# Altium project Detection_Circuit.PrjPcb
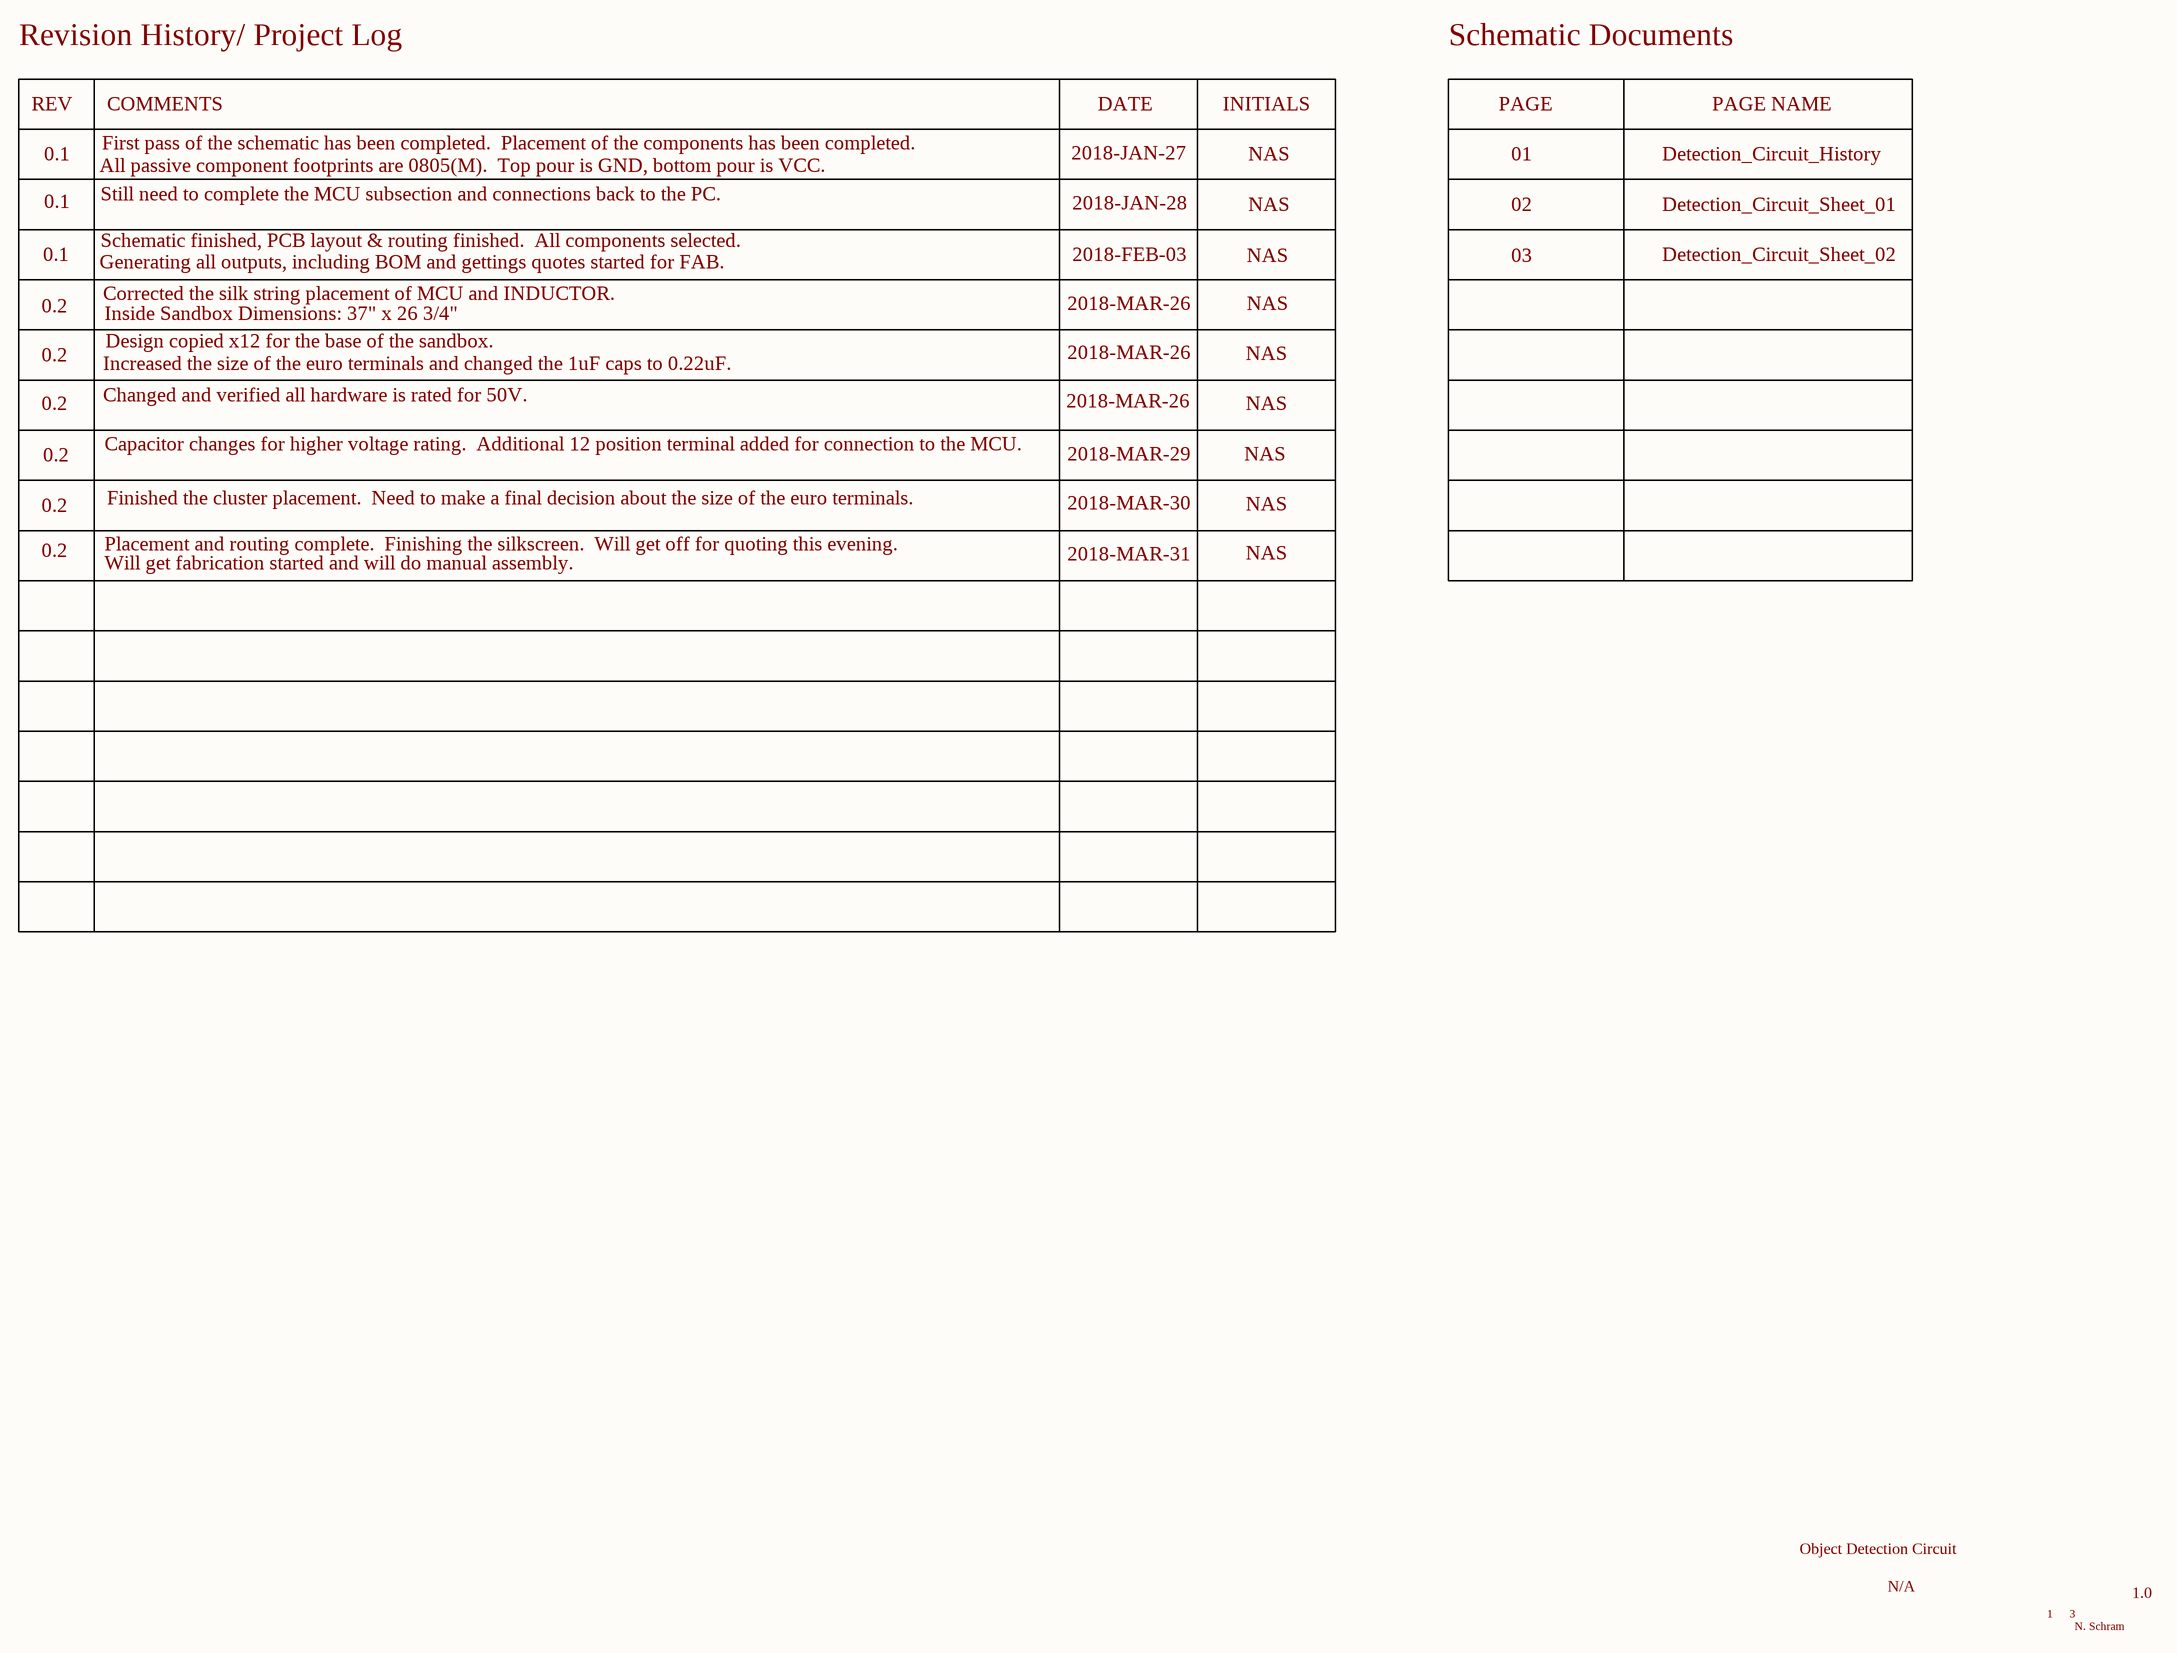
[diagram p0: Detection_Circuit_History.SchDoc]
2 sheets, 41 parts. Net scope: global (net labels, ports and power ports of the same name join across sheets).
Board file: Detection_Circuit_PCB.PcbDoc
Sheets:
  Detection_Circuit_History.SchDoc
  Detection_Circuit_Sheet_01.SchDoc

## Sheet Detection_Circuit_History.SchDoc: Object Detection PCB
size C; Date: 2018-FEB-03; Author: Nathan Schram; DrawnBy: Nathan Schram; Engineer: Nathan Schram; Revision: 1.0; SheetNumber: 1; SheetTotal: 2; DocumentName: Object Detection PCB; ProjectName: Augmented Reality Project

### Notes on the sheet
- Revision History/ Project Log
- Schematic Documents
- REV
- COMMENTS
- DATE
- INITIALS
- PAGE
- PAGE NAME
- 0.1
- All passive component footprints are 0805(M).  Top pour is GND, bottom pour is VCC.
- First pass of the schematic has been completed.  Placement of the components has been completed.
- 2018-JAN-27
- NAS
- 01
- Detection_Circuit_History
- Still need to complete the MCU subsection and connections back to the PC.
- Schematic finished, PCB layout & routing finished.  All components selected.
- 2018-JAN-28
- 02
- Detection_Circuit_Sheet_01
- 0.2
- Generating all outputs, including BOM and gettings quotes started for FAB.
- Corrected the silk string placement of MCU and INDUCTOR.
- 2018-MAR-26
- 2018-FEB-03
- 03
- Detection_Circuit_Sheet_02
- Increased the size of the euro terminals and changed the 1uF caps to 0.22uF.
- Inside Sandbox Dimensions: 37" x 26 3/4"
- Design copied x12 for the base of the sandbox.
- Changed and verified all hardware is rated for 50V.
- Capacitor changes for higher voltage rating.  Additional 12 position terminal added for connection to the MCU.
- Finished the cluster placement.  Need to make a final decision about the size of the euro terminals.
- 2018-MAR-29
- Placement and routing complete.  Finishing the silkscreen.  Will get off for quoting this evening.
- 2018-MAR-30
- 2018-MAR-31
- Will get fabrication started and will do manual assembly.
- Object Detection Circuit
- N/A
- 1
- 3
- N. Schram
- 1.0

## Sheet Detection_Circuit_Sheet_01.SchDoc: Object Detection PCB
size A; Date: 2018-FEB-03; Author: Nathan Schram; DrawnBy: Nathan Schram; Engineer: Nathan Schram; Revision: 1.0; SheetNumber: 2; SheetTotal: 2; ProjectName: Augmented Reality Project
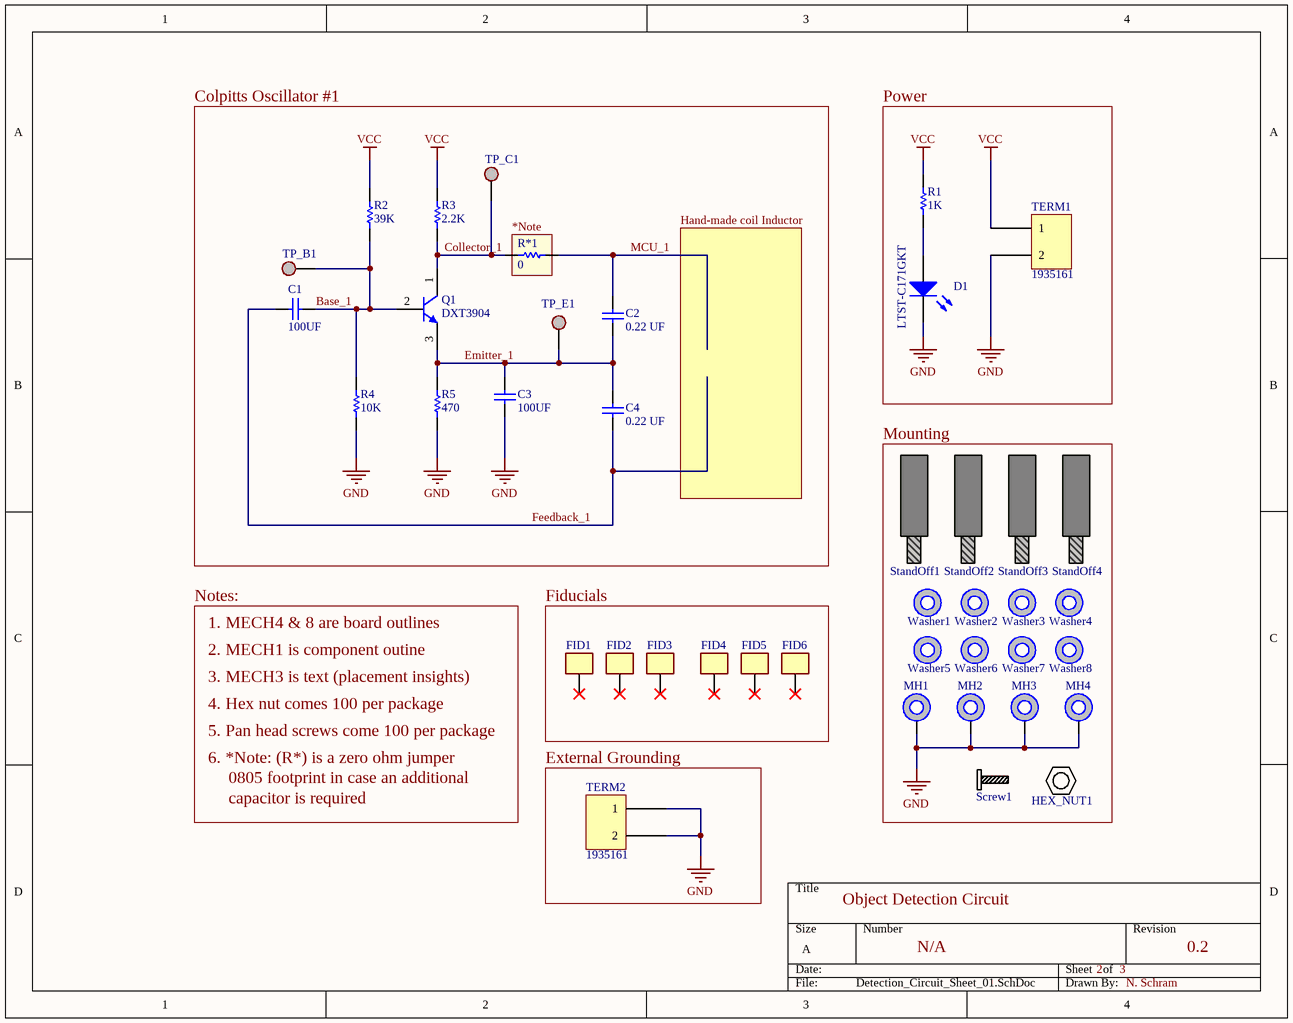
[diagram p1: Detection_Circuit_Sheet_01.SchDoc]

### Parts
C1  100UF  [C1210_M]
C2  Capacitance: 0.22 UF  [6-0805_N]  (hidden comment: 08055C224JAT2A)
C3  100UF  [C1210_M]
C4  Capacitance: 0.22 UF  [6-0805_N]  (hidden comment: 08055C224JAT2A)
D1  LTST-C171GKT  [6-0805_M]
FID1  Fiducial  [Fiducial]  (value not drawn)
FID2  Fiducial  [Fiducial]  (value not drawn)
FID3  Fiducial  [Fiducial]  (value not drawn)
FID4  Fiducial  [Fiducial]  (value not drawn)
FID5  Fiducial  [Fiducial]  (value not drawn)
FID6  Fiducial  [Fiducial]  (value not drawn)
HEX_NUT1  6-32 Hex Nut  (value not drawn)
MH1  #6 MH  [#6_MH]  (value not drawn)
MH2  #6 MH  [#6_MH]  (value not drawn)
MH3  #6 MH  [#6_MH]  (value not drawn)
MH4  #6 MH  [#6_MH]  (value not drawn)
Q1  DXT3904  [DXT3904-13]
R1  1K  [6-0805_M]
R2  39K  [6-0805_M]
R3  2.2K  [6-0805_M]
R4  10K  [6-0805_M]
R5  470  [6-0805_M]
R*1  0  [6-0805_M]
Screw1  6-32 Pan Head Screw  (value not drawn)
StandOff1  6-32 Stand Off  (value not drawn)
StandOff2  6-32 Stand Off  (value not drawn)
StandOff3  6-32 Stand Off  (value not drawn)
StandOff4  6-32 Stand Off  (value not drawn)
TERM1  1935161  [1935161]
TERM2  1935161  [1935161]
TP_B1  TestPoint  [TestPoint]  (value not drawn)
TP_C1  TestPoint  [TestPoint]  (value not drawn)
TP_E1  TestPoint  [TestPoint]  (value not drawn)
Washer1  Nylon Washer  (value not drawn)
Washer2  Nylon Washer  (value not drawn)
Washer3  Nylon Washer  (value not drawn)
Washer4  Nylon Washer  (value not drawn)
Washer5  Nylon Washer  (value not drawn)
Washer6  Nylon Washer  (value not drawn)
Washer7  Nylon Washer  (value not drawn)
Washer8  Nylon Washer  (value not drawn)

### Blocks framed on the sheet
Colpitts Oscillator #1: C1-C4 Q1 R2-R5 R*1 TP_B1 TP_C1 TP_E1
Power: D1 R1 TERM1
Mounting: HEX_NUT1 MH1-MH4 Screw1 StandOff1-StandOff4 Washer1-Washer8
Fiducials: FID1-FID6
External Grounding: TERM2

### Nets
GND: C3.1 D1.2(K) MH1.MH MH2.MH MH3.MH MH4.MH R4.1 R5.1 TERM1.2 TERM2.1 TERM2.2
VCC: R1.2 R2.2 R3.2 TERM1.1
Base_1: C1.2 Q1.2(B) R2.1 R4.2 TP_B1.1
Collector_1: Q1.1(C) R3.1 R*1.1 TP_C1.1
Emitter_1: C2.1 C3.2 C4.2 Q1.3(E) R5.2 TP_E1.1
Feedback_1: C1.1 C4.1
MCU_1: C2.2 R*1.2
NetD1_1: D1.1(A) R1.1

Not connected (* = marked no-connect by the designer): FID1 FID*; FID2 FID*; FID3 FID*; FID4 FID*; FID5 FID*; FID6 FID*

### Notes on the sheet
- (near R*1) *Note
- Hand-made coil Inductor
- Notes:
- 1. MECH4 & 8 are board outlines
- 2. MECH1 is component outine
- 3. MECH3 is text (placement insights)
- 4. Hex nut comes 100 per package
- 5. Pan head screws come 100 per package
- 6. *Note: (R*) is a zero ohm jumper
- 0805 footprint in case an additional
- capacitor is required
- Object Detection Circuit
- N/A
- 2
- 3
- 0.2
- N. Schram

### Library data of the parts
C1 C3 = CC1210MKX5R7BB107: CAP CER 100UF 16V X5R 1210; Manufacturer: Yageo; Capacitance: 100µF; Tolerance: ±20%; Supplier 1: Digi-Key; Manufacturer Part Number: CC1210MKX5R7BB107; Family: Ceramic Capacitors; Series: CC; Packaging: Tape & Reel (TR); Voltage - Rated: 16V; Temperature Coefficient: X5R; Mounting Type: Surface Mount, MLCC; Operating Temperature: -55°C ~ 85°C; Applications: General Purpose; Ratings: -; Package / Case: 1210 (3225 Metric); Size / Dimension: 0.126" L x 0.098" W (3.20mm x 2.50mm); Height - Seated (Max): -; Thickness (Max): 0.110" (2.80mm); Lead Spacing: -; Features: -; Lead Style: -; ComponentLink1URL: http://www.mouser.com/ds/2/447/Yageo_UPY-GP_NP0_16V-to-50V_9-358835.pdf; ComponentLink1Description: http://www.mouser.com/ds/2/447/Yageo_UPY-GP_NP0_16V-to-50V_9-358835.pdf; ComponentLink2URL: http://www.yageo.com/documents/recent/UPY-GPHC_X5R_4V-to-50V_25.pdf; ComponentLink2Description: http://www.yageo.com/documents/recent/UPY-GPHC_X5R_4V-to-50V_25.pdf; Supplier Part Number 1: 311-2052-1-ND; Stock 1: 19901; Pricing 1: 1=1.82, 10=1.437, 100=1.0778 (USD); Category: Capacitors
C2 C4 = 08055C224JAT2A: CAP CER 0.22UF 50V X7R 0805; Manufacturer: AVX Corporation; Tolerance: ±5%; Notification: Current market demand for these product types have resulted in fluctuating and extending lead times. Lead times may differ.; Supplier 1: Digi-Key; Manufacturer Part Number: 08055C224JAT2A; RoHS: RoHS Compliant; Category: Capacitors; Stock 1: 25172; Pricing 1: 1=0.55, 10=0.387, 100=0.255, 500=0.18886, 1000=0.16053 (USD); Packaging: Cut Tape (CT); Part Status: Active; Voltage - Rated: 50V; Temperature Coefficient: X7R; Operating Temperature: -55°C ~ 125°C; Features: -; Ratings: -; Applications: General Purpose; Mounting Type: Surface Mount, MLCC; Package / Case: 0805 (2012 Metric); Size / Dimension: 0.079" L x 0.049" W (2.00mm x 1.25mm); Height - Seated (Max): -; Thickness (Max): 0.037" (0.94mm); Lead Spacing: -; Lead Style: -; ComponentLink1URL: http://datasheets.avx.com/X7RDielectric.pdf; ComponentLink1Description: http://datasheets.avx.com/X7RDielectric.pdf; Supplier Part Number 1: 478-7437-1-ND
D1 = LED3: LED GREEN CLEAR 0805 SMD; Manufacturer: Vishay Lite-On; Chip Material: GaP; DELETED: Compliant; Dominant Wave Length: 569 nm; Emitting Color: Yellow Green; Forward Current: 30 mA; Forward Voltage: 2.6 V; High Brightness: No; Lum Intensity: 12mcd; Main Category: Chip LED; Number of  Elements: 1; Peak Wavelength: 565 nm; Power Dissipation: 100 W; Product Depth (mm): 1.25 mm; Product Height (mm): 0.8 mm; Product Length (mm): 2 mm; Reverse Voltage: 5 V; Shape Type: Rectangular; Test Current (It): 10 mA; Type: Uni-Color; Viewing Angle: 130 deg; Supplier 1: Digi-Key; Supplier Part Number 1: 160-1423-1-ND; Manufacturer Part Number: LTST-C171GKT; Stock 1: 158224; Pricing 1: 1=0.3, 10=0.238, 100=0.1296, 250=0.0864, 500=0.0734, 1000=0.0562 (USD); Lens Dimensions: 1.25X1.4X0.5 mm; Luminous Intensity: 12mcd; Mounting: Surface Mount; Operating Temp Range: -55C to 85C; Operating Temperature Classification: Industrial; Package Type: Chip Led; Packaging: Tape and Reel; Pin Count: 2; Rad Hardened: No; ComponentLink1URL: https://datasheet.ciiva.com/2110/ltst-c171gkt-2110000.pdf; ComponentLink1Description: https://datasheet.ciiva.com/2110/ltst-c171gkt-2110000.pdf; ComponentLink2URL: https://datasheet.ciiva.com/2110/ltst-c171gkt-2110001.pdf; ComponentLink2Description: https://datasheet.ciiva.com/2110/ltst-c171gkt-2110001.pdf; ComponentLink3URL: https://datasheet.ciiva.com/2110/ltst-c171gkt-2110002.pdf; ComponentLink3Description: https://datasheet.ciiva.com/2110/ltst-c171gkt-2110002.pdf; ComponentLink4URL: https://datasheet.ciiva.com/16396/ltst-c171gkt-16396549.pdf; ComponentLink4Description: https://datasheet.ciiva.com/16396/ltst-c171gkt-16396549.pdf; ComponentLink5URL: https://datasheet.ciiva.com/11773/0900766b80dc0296-11773991.pdf; ComponentLink5Description: https://datasheet.ciiva.com/11773/0900766b80dc0296-11773991.pdf; ComponentLink6URL: https://datasheet.ciiva.com/12400/lite-on-ltst-c171gkt-190133-12400647.pdf; ComponentLink6Description: https://datasheet.ciiva.com/12400/lite-on-ltst-c171gkt-190133-12400647.pdf
HEX_NUT1 = HEX_NUT: HEX NUT 0.245" STEEL 6-32; Manufacturer Part Number: 4701; Brand: Keystone Electronics; Gender: Female; Plating: Zinc; Supplier 1: Digi-Key; Factory Pack Quantity: 100; Features: Universal Mounting Kits; Length: 6.22 mm; Thickness: 2.41 mm; Width: 6.22 mm; Product Category: Screws & Fasteners; Type: Nuts; Thread Size: 6-32; Material: Steel; ComponentLink1URL: https://datasheet.ciiva.com/41799/4701-41799174.pdf; ComponentLink1Description: https://datasheet.ciiva.com/41799/4701-41799174.pdf; ComponentLink2URL: https://datasheet.ciiva.com/18416/70181805-18416126.pdf; ComponentLink2Description: https://datasheet.ciiva.com/18416/70181805-18416126.pdf; Supplier Part Number 1: 36-4701-ND; Manufacturer: Keystone Electronics; Stock 1: 51671; Pricing 1: 1=0.1, 10=0.049, 50=0.0342, 100=0.0293, 250=0.0283, 500=0.0244, 1000=0.0219, 2500=0.0195, 5000=0.0185 (USD); RoHS: Details
MH1-MH4 = MH: #6 Mounting Hole
Q1 = DXT3904-13: TRANS NPN 40V 0.2A SOT89-3; Manufacturer: Diodes; Configuration: Single; Collector- Base Voltage VCBO: 60 V; Emitter- Base Voltage VEBO: 6 V; Collector-Emitter Saturation Voltage: 300 mV; Maximum DC Collector Current: 200 mA; Gain Bandwidth Product fT: 300 MHz; Brand: Diodes Incorporated; DC Collector/Base Gain hfe Min: 30 at 100 mA, 1 V; Pd - Power Dissipation: 1000 mW; Unit Weight: 0.001834 oz; Supplier 1: Digi-Key; Manufacturer Part Number: DXT3904-13; Product Category: Bipolar Transistors - BJT; Mounting Style: SMD/SMT; Package / Case: SOT-89; Transistor Polarity: NPN; Collector- Emitter Voltage VCEO Max: 40 V; Maximum Operating Temperature: + 150 C; Series: DXT3904; Height: 1.5 mm; Length: 4.5 mm; Minimum Operating Temperature: - 55 C; Packaging: Reel; Factory Pack Quantity: 2500; Width: 2.48 mm; ComponentLink1URL: https://datasheet.ciiva.com/979/ds31141-979988.pdf; ComponentLink1Description: https://datasheet.ciiva.com/979/ds31141-979988.pdf; ComponentLink2URL: https://datasheet.ciiva.com/4724/ds31141-4724919.pdf; ComponentLink2Description: https://datasheet.ciiva.com/4724/ds31141-4724919.pdf; ComponentLink3URL: https://datasheet.ciiva.com/17303/ds31141-17303788.pdf; ComponentLink3Description: https://datasheet.ciiva.com/17303/ds31141-17303788.pdf; ComponentLink4URL: https://datasheet.ciiva.com/11206/ds31141-11206239.pdf; ComponentLink4Description: https://datasheet.ciiva.com/11206/ds31141-11206239.pdf; Supplier Part Number 1: DXT3904-13DICT-ND; Stock 1: 10942; Pricing 1: 1=0.53, 10=0.426, 100=0.29, 500=0.2175, 1000=0.1632 (USD); RoHS: True
R1 = RNCP0805FTD1K00: RES SMD 1K OHM 1% 1/4W 0805; Manufacturer: Stackpole Electronics; Power (Watts): 0.25W, 1/4W; Temperature Coefficient: ±100ppm/°C; Supplier 1: Digi-Key; Manufacturer Part Number: RNCP0805FTD1K00; Family: Chip Resistor - Surface Mount; Series: RNCP; Packaging: Tape & Reel (TR); Resistance (Ohms): 1k; Tolerance: ±1%; Composition: Thin Film; Features: Anti-Sulfur, Moisture Resistant; Operating Temperature: -55°C ~ 155°C; Package / Case: 0805 (2012 Metric); Supplier Device Package: 0805; Size / Dimension: 0.079" L x 0.049" W (2.00mm x 1.25mm); Height: 0.024" (0.60mm); Number of Terminations: 2; ComponentLink1URL: http://www.seielect.com/Catalog/SEI-rncp.pdf; ComponentLink1Description: http://www.seielect.com/Catalog/SEI-rncp.pdf; Supplier Part Number 1: RNCP0805FTD1K00CT-ND; Stock 1: 107354; Pricing 1: 1=0.1, 10=0.037, 100=0.015, 1000=0.0067, 2500=0.0058 (USD); Category: Resistors
R2 = ERJ-PB6D3902V: RES SMD 39K OHM 0.5% 1/4W 0805; Manufacturer: Panasonic; Power (Watts): 0.25W, 1/4W; Temperature Coefficient: ±50ppm/°C; Supplier 1: Digi-Key; Manufacturer Part Number: ERJ-PB6D3902V; Family: Chip Resistor - Surface Mount; Series: ERJ; Packaging: Tape & Reel (TR); Part Status: Active; Resistance (Ohms): 39k; Tolerance: ±0.5%; Composition: Thick Film; Features: Automotive AEC-Q200, Pulse Withstanding; Operating Temperature: -55°C ~ 155°C; Package / Case: 0805 (2012 Metric); Supplier Device Package: 0805; Size / Dimension: 0.079" L x 0.049" W (2.00mm x 1.25mm); Height - Seated (Max): 0.028" (0.70mm); Number of Terminations: 2; Failure Rate: -; ComponentLink1URL: https://industrial.panasonic.com/sa/system/files/data/download/catalog/id_fixed-resistors_e_2.pdf; ComponentLink1Description: https://industrial.panasonic.com/sa/system/files/data/download/catalog/id_fixed-resistors_e_2.pdf; Supplier Part Number 1: P21199CT-ND; Stock 1: 2236; Pricing 1: 1=0.24, 10=0.204, 25=0.1488, 50=0.1078, 100=0.0799, 250=0.0614, 500=0.0483, 1000=0.0335 (USD); Category: Resistors
R3 = ERJ-PB6D2201V: RES SMD 2.2K OHM 0.5% 1/4W 0805; Manufacturer: Panasonic; Power (Watts): 0.25W, 1/4W; Temperature Coefficient: ±50ppm/°C; Supplier 1: Digi-Key; Manufacturer Part Number: ERJ-PB6D2201V; Family: Chip Resistor - Surface Mount; Series: ERJ; Packaging: Tape & Reel (TR); Part Status: Active; Resistance (Ohms): 2.2k; Tolerance: ±0.5%; Composition: Thick Film; Features: Automotive AEC-Q200, Pulse Withstanding; Operating Temperature: -55°C ~ 155°C; Package / Case: 0805 (2012 Metric); Supplier Device Package: 0805; Size / Dimension: 0.079" L x 0.049" W (2.00mm x 1.25mm); Height - Seated (Max): 0.028" (0.70mm); Number of Terminations: 2; Failure Rate: -; ComponentLink1URL: https://industrial.panasonic.com/sa/system/files/data/download/catalog/id_fixed-resistors_e_2.pdf; ComponentLink1Description: https://industrial.panasonic.com/sa/system/files/data/download/catalog/id_fixed-resistors_e_2.pdf; Supplier Part Number 1: P21055CT-ND; Stock 1: 3147; Pricing 1: 1=0.24, 10=0.204, 25=0.1488, 50=0.1078, 100=0.0799, 250=0.0614, 500=0.0483, 1000=0.0335 (USD); Category: Resistors
R4 = RNCP0805FTD10K0: RES SMD 10K OHM 1% 1/4W 0805; Manufacturer: Stackpole Electronics; Power (Watts): 0.25W, 1/4W; Temperature Coefficient: ±100ppm/°C; Supplier 1: Digi-Key; Manufacturer Part Number: RNCP0805FTD10K0; Family: Chip Resistor - Surface Mount; Series: RNCP; Packaging: Tape & Reel (TR); Resistance (Ohms): 10k; Tolerance: ±1%; Composition: Thin Film; Features: Anti-Sulfur, Moisture Resistant; Operating Temperature: -55°C ~ 155°C; Package / Case: 0805 (2012 Metric); Supplier Device Package: 0805; Size / Dimension: 0.079" L x 0.049" W (2.00mm x 1.25mm); Height: 0.024" (0.60mm); Number of Terminations: 2; ComponentLink1URL: http://www.seielect.com/Catalog/SEI-rncp.pdf; ComponentLink1Description: http://www.seielect.com/Catalog/SEI-rncp.pdf; Supplier Part Number 1: RNCP0805FTD10K0CT-ND; Stock 1: 103823; Pricing 1: 1=0.1, 10=0.037, 100=0.015, 1000=0.0067, 2500=0.0058 (USD); Category: Resistors
R5 = ERJ-PB6D4700V: RES SMD 470 OHM 0.5% 1/4W 0805; Manufacturer: Panasonic; Power (Watts): 0.25W, 1/4W; Temperature Coefficient: ±50ppm/°C; Supplier 1: Digi-Key; Manufacturer Part Number: ERJ-PB6D4700V; Family: Chip Resistor - Surface Mount; Series: ERJ; Packaging: Cut Tape (CT); Part Status: Active; Resistance (Ohms): 470; Tolerance: ±0.5%; Composition: Thick Film; Features: Automotive AEC-Q200, Pulse Withstanding; Operating Temperature: -55°C ~ 155°C; Package / Case: 0805 (2012 Metric); Supplier Device Package: 0805; Size / Dimension: 0.079" L x 0.049" W (2.00mm x 1.25mm); Height - Seated (Max): 0.028" (0.70mm); Number of Terminations: 2; Failure Rate: -; ComponentLink1URL: https://industrial.panasonic.com/sa/system/files/data/download/catalog/id_fixed-resistors_e_2.pdf; ComponentLink1Description: https://industrial.panasonic.com/sa/system/files/data/download/catalog/id_fixed-resistors_e_2.pdf; Supplier Part Number 1: P20981CT-ND; Stock 1: 2688; Pricing 1: 1=0.24, 10=0.204, 25=0.1488, 50=0.1078, 100=0.0799, 250=0.0614, 500=0.0483, 1000=0.0335 (USD); Category: Resistors
R*1 = ERJ-6GEY0R00V: RES SMD 0 OHM JUMPER 1/8W 0805; Manufacturer: Panasonic ECG; Rated Power: 0.125 W; Resistance: 0 O; Tolerance (%): 0 %; Temp Coefficient: 0 ppm/°C; Supplier 1: Digi-Key; Manufacturer Part Number: ERJ-6GEY0R00V; Size Code: 0805; ComponentLink1URL: https://datasheet.ciiva.com/28695/1678796-28695877.pdf; ComponentLink1Description: https://datasheet.ciiva.com/28695/1678796-28695877.pdf; ComponentLink2URL: https://datasheet.ciiva.com/11821/0900766b80f806dd-11821735.pdf; ComponentLink2Description: https://datasheet.ciiva.com/11821/0900766b80f806dd-11821735.pdf; ComponentLink3URL: https://datasheet.ciiva.com/43460/1678796-43460073.pdf; ComponentLink3Description: https://datasheet.ciiva.com/43460/1678796-43460073.pdf; ComponentLink4URL: https://datasheet.ciiva.com/9117/aoa0000ce1-9117354.pdf; ComponentLink4Description: https://datasheet.ciiva.com/9117/aoa0000ce1-9117354.pdf; ComponentLink5URL: https://datasheet.ciiva.com/46377/1678796-46377866.pdf; ComponentLink5Description: https://datasheet.ciiva.com/46377/1678796-46377866.pdf; ComponentLink6URL: https://datasheet.ciiva.com/36526/1989607-36526237.pdf; ComponentLink6Description: https://datasheet.ciiva.com/36526/1989607-36526237.pdf; ComponentLink7URL: https://datasheet.ciiva.com/17215/aoa0000ce1-17215390.pdf; ComponentLink7Description: https://datasheet.ciiva.com/17215/aoa0000ce1-17215390.pdf; ComponentLink8URL: https://datasheet.ciiva.com/16512/aoa0000ce1-16512111.pdf; ComponentLink8Description: https://datasheet.ciiva.com/16512/aoa0000ce1-16512111.pdf; Supplier Part Number 1: P0.0ACT-ND; Stock 1: 6840904; Pricing 1: 1=0.1, 10=0.053, 25=0.038, 50=0.029, 100=0.0214, 250=0.0163, 500=0.0131, 1000=0.0096 (USD)
Screw1 = 6-32 Screw: MACHINE SCREW PAN PHILLIPS 6-32; Manufacturer Part Number: PMSSS6320050PH; Manufacturer: B&F Fastener; Head Height: 0.092" (2.34mm); Dynamic Catalog: Stainless Steel Screws; Kits: 1608-KIT-ND / - STAINLESS STL HARDWARE #6,#8,#10; Other Names: H711; Supplier 1: Digi-Key; Standard Package: 100; Family: Screws, Bolts; Type: Machine Screw; Screw Head Type: Pan Head; Drive Type: Phillips; Thread Size: 6-32; Length - Below Head: 0.500" (12.70mm) 1/2"; Length - Overall: 0.592" (15.04mm); Material: Stainless Steel; ComponentLink1URL: https://datasheet.ciiva.com/1034/machinepancombo-1034179.pdf; ComponentLink1Description: https://datasheet.ciiva.com/1034/machinepancombo-1034179.pdf; Supplier Part Number 1: H711-ND; Stock 1: 15276; Pricing 1: 100=0.0773, 1000=0.0618 (USD); Category: Hardware, Fasteners, Accessories
StandOff1-StandOff4 = STANDOFF: HEX STANDOFF 6-32 ALUMINUM 3/4"; Manufacturer Part Number: 8416; Manufacturer: Keystone Electronics; Threaded/Unthreaded: Threaded; Gender: Male, Female; Screw, Thread Size: #6-32; Between Board Height: 0.750" (19.05mm) 3/4"; Plating: Iridite; Supplier 1: Digi-Key; Family: Board Spacers, Standoffs; Series: -; Type: Hex Standoff; Diameter - Inside: -; Diameter - Outside: 0.250" (6.35mm) 1/4" Hex; Length - Overall: 1.000" (25.40mm) 1"; Features: -; Material: Aluminum; Color: -; Weight: -; ComponentLink1URL: https://datasheet.ciiva.com/5225/m60-2p70-311182-5225146.pdf; ComponentLink1Description: https://datasheet.ciiva.com/5225/m60-2p70-311182-5225146.pdf; ComponentLink2URL: https://datasheet.ciiva.com/14533/70181845-14533167.pdf; ComponentLink2Description: https://datasheet.ciiva.com/14533/70181845-14533167.pdf; Supplier Part Number 1: 36-8416-ND; Stock 1: 20629; Pricing 1: 1=0.74, 10=0.55, 50=0.44, 100=0.4217, 250=0.385, 1000=0.3079, 2500=0.2751, 5000=0.2659 (USD); Category: Hardware, Fasteners, Accessories
TERM1 TERM2 = 1935161: TERM BLOCK PCB 2POS 5.0MM GREEN; Manufacturer: Phoenix Contact; Positions Per Level: 2; Pitch: 0.197" (5.00mm); Mating Orientation: Horizontal with Board; Wire Gauge: 12-26 AWG; Wire Termination: Screw; Torque - Screw: 0.35-0.4 Nm (3.1-3.5 Lb-In); Screw Thread: M2.6; Supplier 1: Digi-Key; Manufacturer Part Number: 1935161; RoHS: RoHS Compliant; Category: Connectors, Interconnects; Stock 1: 18819; Pricing 1: 1=0.41, 10=0.391, 50=0.374, 100=0.3638, 250=0.34, 500=0.3128, 1000=0.289 (USD); Packaging: Bulk; Part Status: Active; Mounting Type: Through Hole; Features: Interlocking (Side); Color: Green; Operating Temperature: -; Housing Material: Polyamide (PA), Nylon; Contact Material - Plating: -; Clamp Material - Plating: -; Screw Material - Plating: -; ComponentLink1URL: https://media.digikey.com/pdf/Data%20Sheets/Phoenix%20Contact%20PDFs/1935161.pdf; ComponentLink1Description: https://media.digikey.com/pdf/Data%20Sheets/Phoenix%20Contact%20PDFs/1935161.pdf; Supplier Part Number 1: 277-1667-ND
TP_B1 TP_C1 TP_E1 = TestPoint: Test Point
Washer1-Washer8 = Washer: MACHINE SCREW PAN PHILLIPS 6-32; Manufacturer Part Number: 3349; Manufacturer: Keystone Electronics; Catalog Drawings: Flat Washer Side; Thread/Screw/Hole Size: #6; Dynamic Catalog: Nylon and Fiber Flat Washers; Other Names: 3349K; Supplier 1: Digi-Key; Standard Package: 100; Family: Washers; Type: Flat; Diameter - Inside: 0.140" (3.56mm); Diameter - Outside: 0.312" (7.92mm); Thickness: 0.032" (0.81mm); Material: Nylon; ComponentLink1URL: https://datasheet.ciiva.com/16215/m60-2p131-16215696.pdf; ComponentLink1Description: https://datasheet.ciiva.com/16215/m60-2p131-16215696.pdf; Supplier Part Number 1: 3349K-ND; Stock 1: 26447; Pricing 1: 10=0.064, 50=0.0564, 100=0.0393, 250=0.0339, 500=0.0325, 1000=0.0285, 2500=0.0257, 5000=0.0244 (USD); Category: Hardware, Fasteners, Accessories